# EAGLE design basic-handheld-turbidimeter (EAGLE 7.3.0)
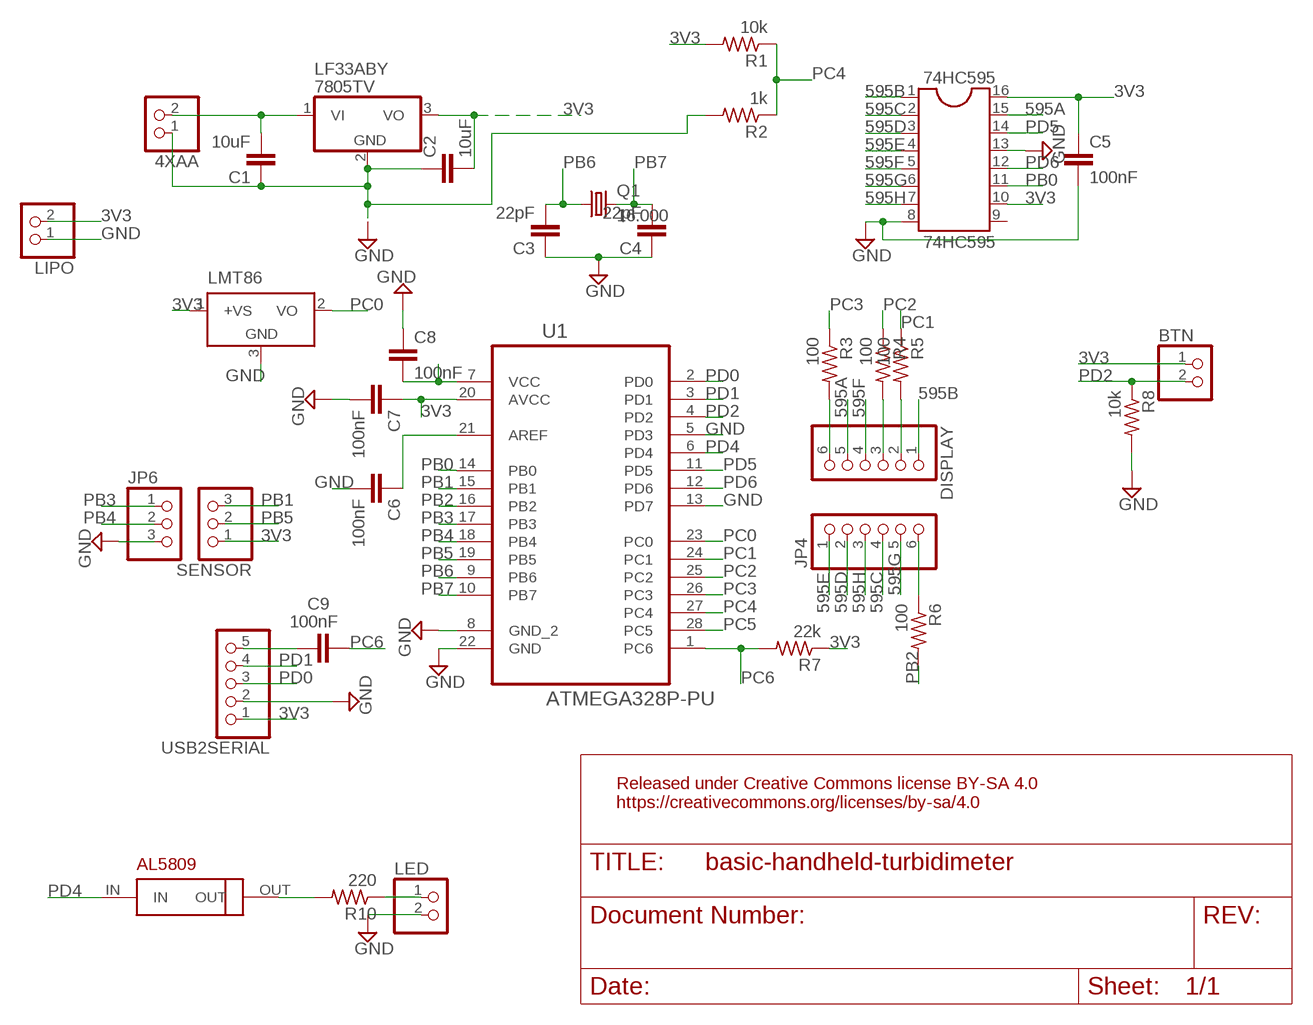
[diagram p0: schematic, sheet 1]

## Parts
4XAA  PINHD-1X2  [1X02]
74HC595  74HC595  DIL16  [DIL16]
BTN  PINHD-1X2  [1X02]
C1  10uF  CAPEZ  [CAP-PTH-SMALLEZ]
C2  10uF  CAPEZ  [CAP-PTH-SMALLEZ]
C3  22pF  CAPEZ  [CAP-PTH-SMALLEZ]
C4  22pF  CAPEZ  [CAP-PTH-SMALLEZ]
C5  100nF  CAPEZ  [CAP-PTH-SMALLEZ]
C6  100nF  CAPEZ  [CAP-PTH-SMALLEZ]
C7  100nF  CAPEZ  [CAP-PTH-SMALLEZ]
C8  100nF  CAPEZ  [CAP-PTH-SMALLEZ]
C9  100nF  CAPEZ  [CAP-PTH-SMALLEZ]
DISPLAY  PINHD-1X6  [1X06]
JP4  PINHD-1X6  [1X06]
JP6  PINHD-1X3  [1X03]
LED  PINHD-1X2  [1X02]
LF33ABY  7805TV  [TO220V]
LIPO  PINHD-1X2  [1X02]
LMT86  LM35CZ  [TO92]
Q1  16.000  CRYSTALHC49S  [HC49/S]
R1  10k  R-US_0207/12  [0207/12]
R2  1k  R-US_0207/12  [0207/12]
R3  100  R-US_0207/12  [0207/12]
R4  100  R-US_0207/12  [0207/12]
R5  100  R-US_0207/12  [0207/12]
R6  100  R-US_0207/12  [0207/12]
R7  22k  R-US_0207/12  [0207/12]
R8  10k  R-US_0207/12  [0207/12]
R10  220  R-US_0207/12  [0207/12]
SENSOR  PINHD-1X3  [1X03]
U1  ATMEGA328P-PU  [DIP254P762X457-28]
U$6  AL5809  [AL5809]
USB2SERIAL  PINHD-1X5  [1X05]

## Nets
3V3: 74HC595.10 74HC595.16 BTN.1 C2.2 C5.1 C7.1 C8.2 LF33ABY.3(VO) LIPO.2 LMT86.1(+VS) R1.2 R7.1 SENSOR.1 U1.7(VCC) U1.20(AVCC) USB2SERIAL.1
595A: 74HC595.15 DISPLAY.5
595B: 74HC595.1 DISPLAY.1
595C: 74HC595.2 JP4.4
595D: 74HC595.3 JP4.2
595E: 74HC595.4 JP4.1
595F: 74HC595.5 DISPLAY.4
595G: 74HC595.6 JP4.5
595H: 74HC595.7 JP4.3
GND: 4XAA.1 74HC595.8 74HC595.13 C1.1 C2.1 C3.1 C4.1 C5.2 C6.2 C7.2 C8.1 JP6.3 LED.2 LF33ABY.2(GND) LIPO.1 LMT86.3(GND) R2.2 R8.2 U1.5(PD3) U1.8(GND_2) U1.13(PD7) U1.22(GND) USB2SERIAL.2
LED: LED.1 R10.1
N$1: 4XAA.2 C1.2 LF33ABY.1(VI)
N$2: R10.2 U$6.OUT
N$3: C6.1 U1.21(AREF)
N$6: C9.2 USB2SERIAL.5
N$11: DISPLAY.6 R3.2
N$15: DISPLAY.3 R4.2
N$16: DISPLAY.2 R5.2
N$18: JP4.6 R6.1
PB0: 74HC595.11 U1.14(PB0)
PB1: SENSOR.3 U1.15(PB1)
PB2: R6.2 U1.16(PB2)
PB3: JP6.1 U1.17(PB3)
PB4: JP6.2 U1.18(PB4)
PB5: SENSOR.2 U1.19(PB5)
PB6: C3.2 Q1.1 U1.9(PB6)
PB7: C4.2 Q1.2 U1.10(PB7)
PC0: LMT86.2(VO) U1.23(PC0)
PC1: R5.1 U1.24(PC1)
PC2: R4.1 U1.25(PC2)
PC3: R3.1 U1.26(PC3)
PC4: R1.1 R2.1 U1.27(PC4)
PC5: U1.28(PC5)
PC6: C9.1 R7.2 U1.1(PC6)
PD0: U1.2(PD0) USB2SERIAL.3
PD1: U1.3(PD1) USB2SERIAL.4
PD2: BTN.2 R8.1 U1.4(PD2)
PD4: U1.6(PD4) U$6.IN
PD5: 74HC595.14 U1.11(PD5)
PD6: 74HC595.12 U1.12(PD6)
Unconnected: 74HC595.9

## Notes on the sheet
- Released under Creative Commons license BY-SA 4.0
  https://creativecommons.org/licenses/by-sa/4.0

## Library data of the parts
4XAA BTN LED LIPO = pinhead:PINHD-1X2: PIN HEADER
74HC595 = ic-package:DIL16: Dual In Line / Socket
C1-C9 = SparkFun-Capacitors:CAP: Capacitor Standard 0603 ceramic capacitor, and 0.1" leaded capacitor.
DISPLAY JP4 = pinhead:PINHD-1X6: PIN HEADER
JP6 SENSOR = pinhead:PINHD-1X3: PIN HEADER
LF33ABY = linear:78*: Positive VOLTAGE REGULATOR Source: http://cache.national.com/ds/LM/LM78L05.pdf http://www.fairchildsemi.com/ds/LM/LM7805.pdf
LMT86 = lm35:LM35: Single-Supply Centigrade Temperature Sensor Vout = (10mV/°C x Temp °C) +5mmmV Source: http://www.national.com/ds/LM/LM35.pdf
Q1 = adafruit:CRYSTAL: CRYSTAL; OC_FARNELL: 1667008; OC_NEWARK: unknown
R1-R8 R10 = rcl:R-US_: RESISTOR, American symbol
U1 = Atmel_By_element14_Batch_1-00:ATMEGA328P-PU: 8-bit Microcontroller with In-System Programmable Flash; MPN: ATMEGA328P-PU; OC_FARNELL: 1715487; OC_NEWARK: 15R0268; PACKAGE: PDIP-28; SUPPLIER: Atmel
U$6 = awqua_eagle_library:AL5809
USB2SERIAL = pinhead:PINHD-1X5: PIN HEADER

## Board
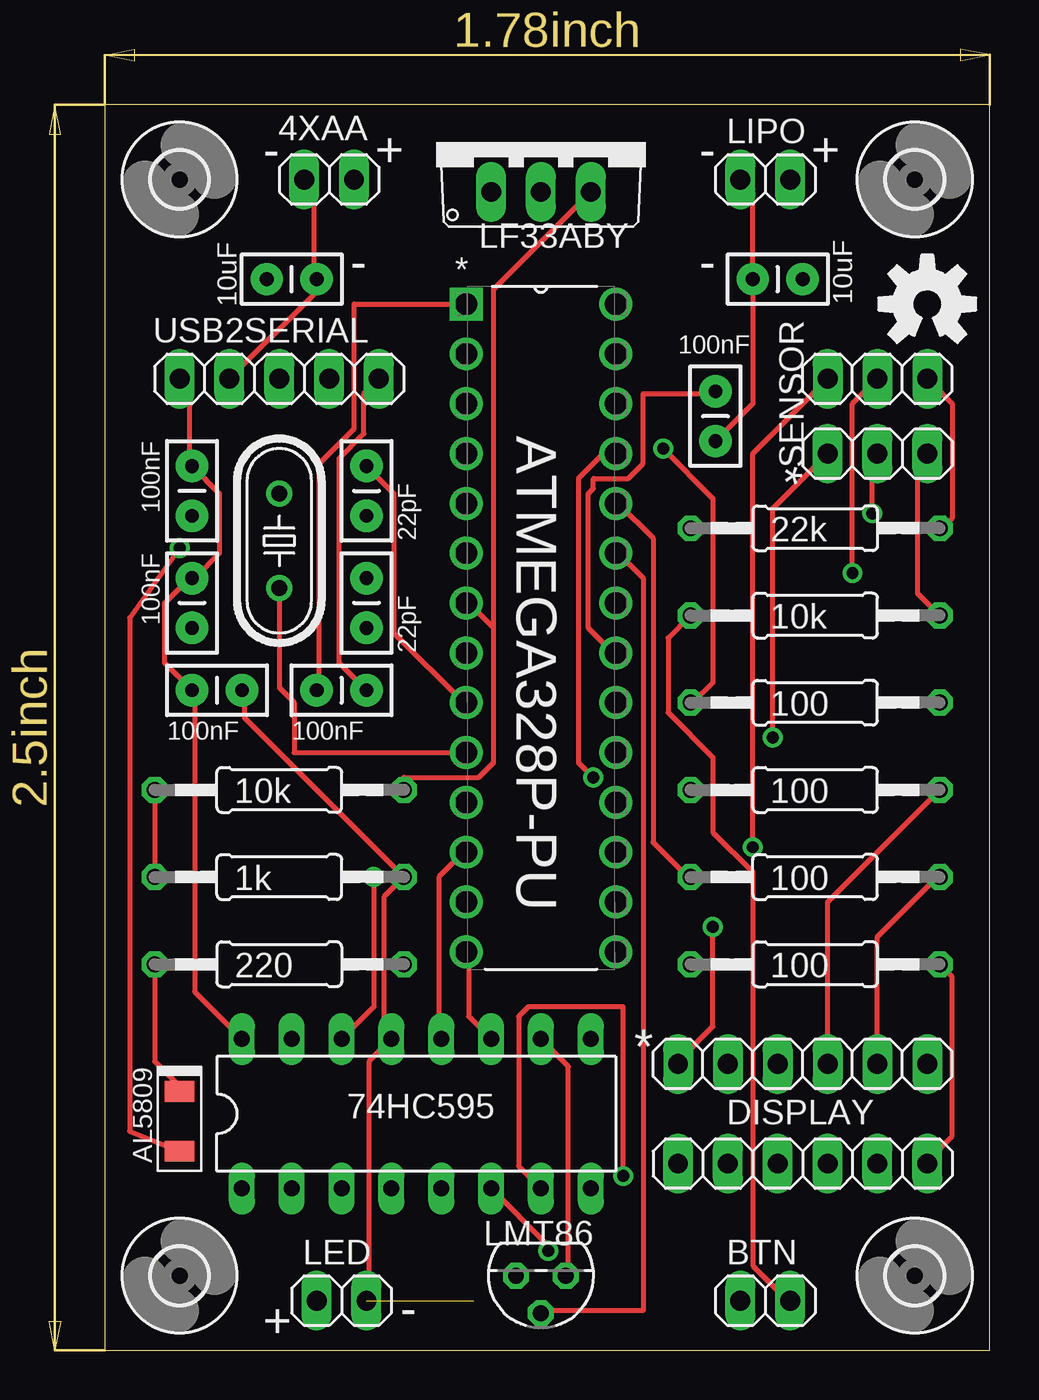
[diagram p1: board, top side]
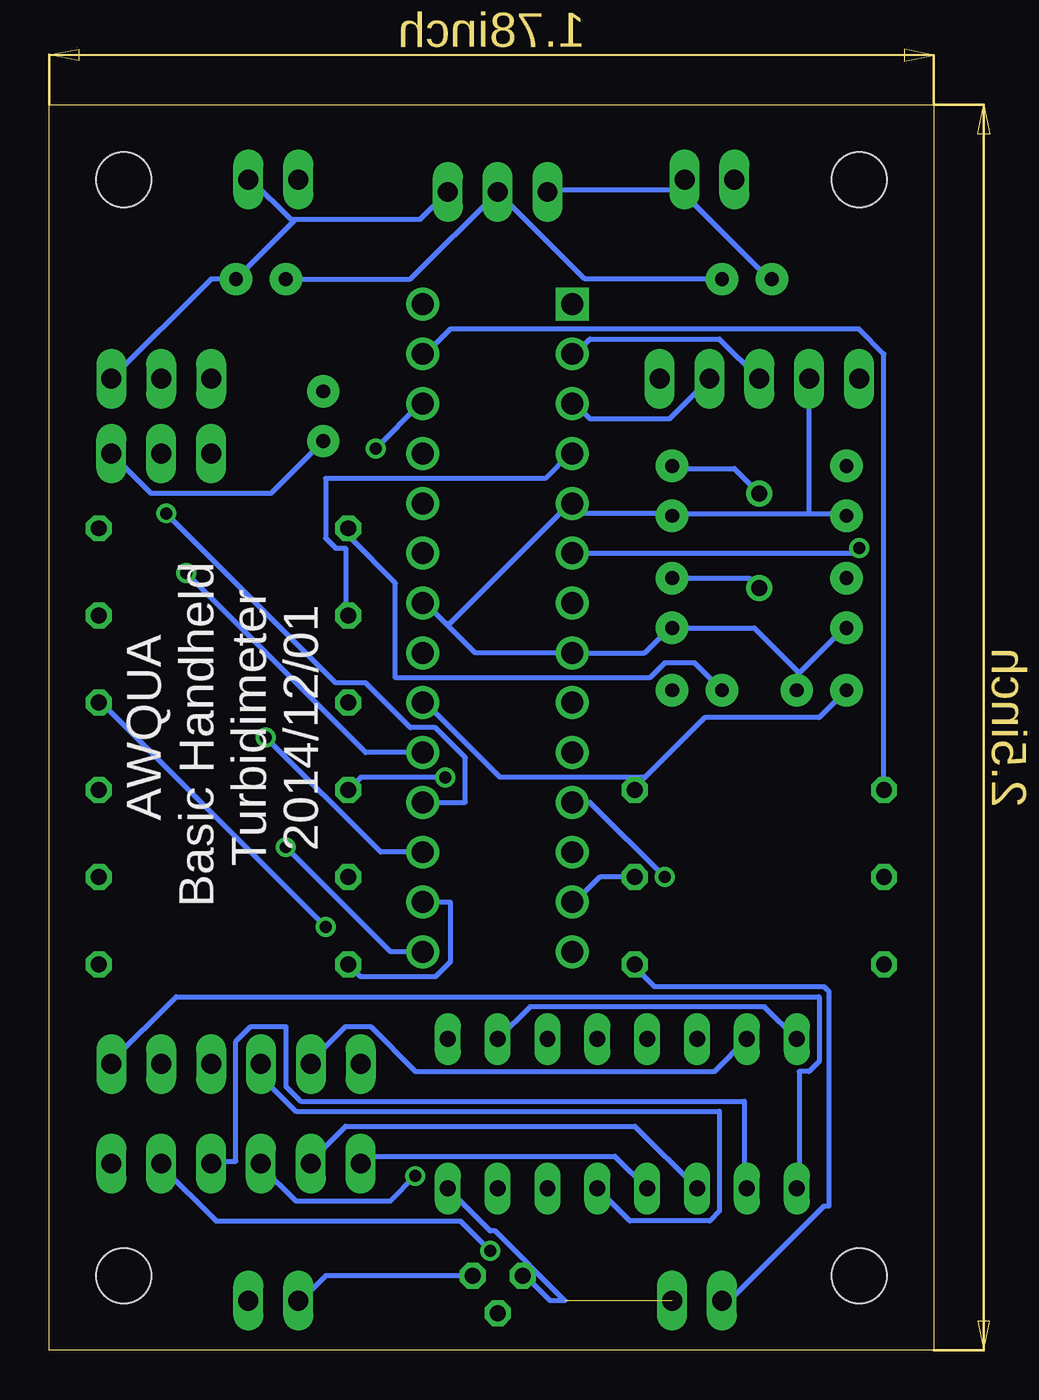
[diagram p2: board, bottom side, seen from below]

Size 45.09 x 63.5 mm. Coordinates in mm from the lower left corner, seen from the top.
Outline: 0,0 45.09,0 45.09,63.5 0,63.49 0,0
Copper layers (1*16): Top 0.035mm / dielectric 1.5mm / Bottom 0.035mm
Design rules "default": minimum track width 10mil, minimum drill 24mil, track to track 8mil, track to pad 8mil, pad to pad 8mil, via to via 8mil, smd to smd 8mil, copper to edge 40mil, drill to drill 8mil, minimum pad ring 10mil, minimum via ring 8mil, stop-mask expansion 4mil, vias tented up to drill 0mil, thermal gap 10mil

### Footprints (pad centres in the part's own frame; a part is rotated, then mirrored left to right if it is on the bottom)
1X02 = drill 1.016 long: 1 -1.27,0; 2 1.27,0
DIL16 = drill 0.813 long: 1 -8.89,-3.81; 2 -6.35,-3.81; 3 -3.81,-3.81; 4 -1.27,-3.81; 5 1.27,-3.81; 6 3.81,-3.81; 7 6.35,-3.81; 8 8.89,-3.81; 9 8.89,3.81; 10 6.35,3.81; 11 3.81,3.81; 12 1.27,3.81; 13 -1.27,3.81; 14 -3.81,3.81; 15 -6.35,3.81; 16 -8.89,3.81
CAP-PTH-SMALLEZ = drill 0.7 pad 1.651: 1 0,0; 2 2.54,0
1X06 = drill 1.016 long: 1 -6.35,0; 2 -3.81,0; 3 -1.27,0; 4 1.27,0; 5 3.81,0; 6 6.35,0
1X03 = drill 1.016 long: 1 -2.54,0; 2 0,0; 3 2.54,0
TO220V = drill 1.016 long: 1 -2.54,-2.54; 2 0,-2.54; 3 2.54,-2.54
TO92 = drill 0.813 octagon: 1 -1.27,0; 2 0,1.905; 3 1.27,0
HC49/S = drill 0.813: 1 -2.413,0; 2 2.413,0
0207/12 = drill 0.813 octagon: 1 -6.35,0; 2 6.35,0
DIP254P762X457-28 = drill 1.118 square: 1 -7.62,33.02 | drill 1.118: 2 -7.62,30.48; 3 -7.62,27.94; 4 -7.62,25.4; 5 -7.62,22.86; 6 -7.62,20.32; 7 -7.62,17.78; 8 -7.62,15.24; 9 -7.62,12.7; 10 -7.62,10.16; 11 -7.62,7.62; 12 -7.62,5.08; 13 -7.62,2.54; 14 -7.62,0; 15 0,0; 16 0,2.54; 17 0,5.08; 18 0,7.62; 19 0,10.16; 20 0,12.7; 21 0,15.24; 22 0,17.78; 23 0,20.32; 24 0,22.86; 25 0,25.4; 26 0,27.94; 27 0,30.48; 28 0,33.02
2,8 = hole 2.8: 0,0
AL5809 = smd 1.05 x 1.5: IN 0,0; OUT 3.05,0
1X05 = drill 1.016 long: 1 -5.08,0; 2 -2.54,0; 3 0,0; 4 2.54,0; 5 5.08,0

### Placement (x,y rotation side)
4XAA  11.43,59.69 0 top
74HC595  15.88,12.06 0 top
BTN  33.66,2.54 0 top
C1  10.79,54.61 180 top
C2  33.02,54.61 0 top
C3  13.34,42.55 90 top
C4  13.34,36.83 90 top
C5  4.45,33.66 0 top
C6  31.11,48.9 270 top
C7  4.45,45.09 270 top
C8  4.45,36.83 90 top
C9  10.79,33.66 0 top
DISPLAY  35.56,14.61 180 top
JP4  35.56,9.53 0 top
JP6  39.37,45.72 0 top
LED  12.06,2.54 0 top
LF33ABY  22.23,61.59 0 top
LIPO  33.66,59.69 0 top
LMT86  22.23,3.81 180 top
Q1  8.89,41.27 270 top
R1  8.89,28.57 0 top
R2  8.89,24.13 0 top
R3  36.2,33.02 0 top
R4  36.2,28.57 0 top
R5  36.2,24.13 0 top
R6  36.2,19.68 180 top
R7  36.2,41.91 180 top
R8  36.2,37.47 0 top
R10  8.89,19.68 180 top
SENSOR  39.37,49.53 180 top
U1  26.04,20.32 0 top
U$1  [2,8]  3.81,59.69 0 top
U$2  [2,8]  41.27,59.69 0 top
U$3  [2,8]  3.81,3.81 0 top
U$4  [2,8]  41.27,3.81 0 top
U$5  [OSHW-LOGO-M]  41.91,53.34 0 top
U$6  3.81,10.16 90 top
USB2SERIAL  8.89,49.53 0 top

### Tracks (layer width: path | path; a pad name or v marks a point on that pad's centre or on a via)
3V3
  Top 0.254: SENSOR.1 43.18,48.26 43.18,42.42 42.67,41.91 R7.1 | 74HC595.10 23.62,14.48 23.62,3.81 LMT86.1 | USB2SERIAL.1 4.32,49.02 4.32,45.21 C7.1 5.84,43.69 5.84,40.64 4.57,39.37 C8.2 4.32,39.37 3.05,38.1 3.05,35.05 C5.1 4.57,33.53 4.57,18.29 74HC595.16 | 19.81,36.83 18.54,38.1 U1.7 | 19.81,36.83 19.81,29.97 19.05,29.21 15.24,29.21 R1.2 | LF33ABY.3 19.81,54.1 19.81,36.83
  Bottom 0.254: LF33ABY.3 26.16,57.66 32.51,57.66 | 32.51,57.66 32.77,57.66 34.8,59.69 LIPO.2 | 32.51,57.66 C2.2 36.83,54.61 SENSOR.1 | LMT86.1 30.99,3.81 32.26,2.54 BTN.1 | 14.73,29.21 11.68,32.26 5.84,32.26 C5.1 | 14.73,29.21 15.24,28.7 R1.2 | 14.73,29.21 22.1,29.21 25.91,33.02 U1.20 | 74HC595.10 20.57,17.53 8.64,17.53 74HC595.16
595A
  Bottom 0.254: 74HC595.15 11.18,14.22 26.42,14.22 28.7,16.51 29.97,16.51 31.75,14.73 DISPLAY.5
595B
  Bottom 0.254: 74HC595.1 6.86,8.38 6.86,14.22 6.35,14.22 5.84,14.73 5.84,18.03 38.61,18.03 41.91,14.73 DISPLAY.1
595C
  Bottom 0.254: 74HC595.2 9.65,8.38 9.65,12.7 32.26,12.7 33.02,13.46 33.02,16.51 34.8,16.51 35.56,15.75 35.56,9.65 36.83,9.65 JP4.4
595D
  Bottom 0.254: 74HC595.3 15.24,11.43 29.97,11.43 31.75,9.65 JP4.2
595E
  Bottom 0.254: 74HC595.4 16.26,9.91 28.96,9.91 29.21,9.65 JP4.1
595F
  Bottom 0.254: 74HC595.5 15.49,6.6 11.43,6.6 10.92,7.11 10.92,12.19 32.51,12.19 34.29,13.97 DISPLAY.4
595G  (via drill 0.61)
  Top 0.254: 74HC595.6 22.61,5.33 v22.61,5.08
  Bottom 0.254: v22.61,5.08 24.13,6.6 36.58,6.6 39.37,9.4 JP4.5
595H  (via drill 0.61)
  Top 0.254: 74HC595.7 21.08,9.4 21.08,17.02 21.59,17.53 26.42,17.53 v26.42,8.89
  Bottom 0.254: v26.42,8.89 27.69,7.62 32.51,7.62 34.29,9.4 JP4.3
GND  (2 unrouted)
  Top 0.254: R8.2 41.4,38.61 41.4,45.21 JP6.3 | LIPO.1 32.51,59.69 33.02,59.18 C2.1 33.02,48.26 C6.2 | USB2SERIAL.2 10.67,53.85 10.67,54.61 | 4XAA.1 10.67,59.18 10.67,54.61 | 10.67,54.61 C1.1 | C5.2 7.11,33.53 7.11,32.26 R2.2 14.22,23.11 14.22,16.26 74HC595.13 13.46,14.73 13.46,2.54
  Bottom 0.254: C2.1 26.67,54.61 LF33ABY.2 17.78,54.61 C1.1 | JP6.3 39.88,43.69 33.78,43.69 C6.2 | 6.35,42.67 13.21,42.67 C3.1 13.46,42.67 17.78,42.67 18.29,43.18 U1.5 18.54,43.18 24.64,37.08 24.89,37.08 | 6.35,42.67 4.57,42.67 C7.2 | 6.35,42.67 USB2SERIAL.2 | LMT86.3 20.83,3.81 19.56,2.54 18.8,2.54 22.35,6.1 22.61,6.1 74HC595.8 | R2.2 17.02,24.13 18.29,22.86 U1.13 | 6.86,34.54 4.57,36.83 C8.1 | 6.86,34.54 6.86,33.78 C5.2 | 24.89,37.08 23.37,35.56 U1.8 14.73,35.56 13.46,36.83 C4.1 9.14,36.83 6.86,34.54 | 24.89,37.08 25.91,38.1 U1.22
LED
  Bottom 0.254: LED.1 10.41,2.54 5.59,7.37 5.33,7.37 5.33,18.29 5.59,18.54 14.22,18.54 15.24,19.56 R10.1
N$1
  Bottom 0.254: 13.21,59.18 19.56,59.18 LF33ABY.1 | 13.21,59.18 12.95,59.18 8.38,54.61 C1.2 | 13.21,59.18 4XAA.2
N$2
  Top 0.254: R10.2 2.54,14.73 3.81,13.46 U$6.OUT
N$3
  Top 0.254: C6.1 30.99,48.77 27.43,48.77 27.43,45.21 26.67,44.45 24.89,44.45 24.89,43.94 24.64,43.69 24.64,36.83 25.91,35.56 U1.21
N$6
  Top 0.254: USB2SERIAL.5 13.21,48.77 13.21,46.74 11.94,45.47 11.94,35.05 C9.2
N$11  (via drill 0.61)
  Top 0.254: v30.99,21.59 30.99,16.51 29.21,14.73 DISPLAY.6
  Bottom 0.254: v30.99,21.59 42.42,33.02 R3.2
N$15
  Top 0.254: R4.2 36.83,22.86 DISPLAY.3
N$16
  Top 0.254: DISPLAY.2 39.37,21.08 42.42,24.13 R5.2
N$18
  Top 0.254: R6.1 43.18,19.05 43.18,10.92 41.91,9.65 JP4.6
PB0
  Top 0.254: 74HC595.11 18.54,17.02 18.54,20.32 U1.14
PB1  (via drill 0.61)
  Top 0.254: SENSOR.3 33.02,45.72 v33.02,25.65
  Bottom 0.254: v33.02,25.65 27.69,20.32 U1.15
PB2
  Bottom 0.254: R6.2 29.21,19.05 25.4,19.05 24.64,19.81 24.64,22.86 U1.16
PB3  (via drill 0.61)
  Top 0.254: JP6.1 34.04,42.93 v34.04,31.24
  Bottom 0.254: v34.04,31.24 28.19,25.4 U1.17
PB4  (via drill 0.61)
  Top 0.254: JP6.2 39.12,45.47 v39.12,42.67
  Bottom 0.254: v39.12,42.67 30.48,34.04 28.96,34.04 26.67,31.75 25.4,31.75 23.88,30.23 23.88,27.94 U1.18
PB5  (via drill 0.61)
  Top 0.254: SENSOR.2 38.1,48.26 v38.1,39.62
  Bottom 0.254: v38.1,39.62 28.96,30.48 U1.19
PB6
  Top 0.254: C3.2 14.73,43.69 14.73,36.58 18.29,33.02 U1.9
  Bottom 0.254: Q1.1 10.16,44.96 13.21,44.96 C3.2
PB7
  Top 0.254: U1.10 9.65,30.48 9.65,33.02 8.89,33.78 Q1.2
  Bottom 0.254: Q1.2 9.4,39.37 C4.2
PC0
  Top 0.254: LMT86.2 22.35,2.03 27.43,2.03 27.43,39.37 26.16,40.64 U1.23
PC1
  Top 0.254: R5.1 29.72,24.13 27.94,25.91 27.94,41.4 26.16,43.18 U1.24
PC2  (via drill 0.61)
  Top 0.254: v24.89,29.21 24.13,29.97 24.13,44.45 25.4,45.72 U1.25
  Bottom 0.254: R4.1 29.21,29.21 v24.89,29.21
PC3  (via drill 0.61)
  Top 0.254: v28.45,45.97 30.99,43.43 30.99,34.04 29.97,33.02 R3.1
  Bottom 0.254: v28.45,45.97 26.16,48.26 U1.26
PC4
  Top 0.254: R1.1 R2.1
  Bottom 0.254: R1.1 2.54,50.8 3.81,52.07 24.64,52.07 25.91,50.8 U1.27
PC6
  Top 0.254: U1.1 12.7,53.34 12.7,46.99 10.92,45.21 10.92,33.78 C9.1
  Bottom 0.254: C9.1 12.19,35.05 13.72,35.05 14.48,34.29 27.43,34.29 27.43,39.12 29.72,41.4 29.72,41.91 R7.2
PD0
  Bottom 0.254: USB2SERIAL.3 10.92,51.56 17.53,51.56 18.29,50.8 U1.2
PD1
  Bottom 0.254: USB2SERIAL.4 13.46,47.5 17.53,47.5 18.29,48.26 U1.3
PD2
  Top 0.254: R8.1 28.7,36.32 28.7,32.51 30.99,30.23 30.99,26.42 33.02,24.38 33.02,4.32 34.8,2.54 BTN.2
  Bottom 0.254: R8.1 29.97,37.59 29.97,40.89 30.48,40.89 30.99,41.4 30.99,44.45 19.81,44.45 18.54,45.72 U1.4
PD4  (via drill 0.61)
  Top 0.254: U$6.IN 1.27,11.18 1.27,37.34 v3.81,40.89
  Bottom 0.254: v3.81,40.89 4.06,40.64 U1.6
PD5  (via drill 0.61)
  Top 0.254: 74HC595.14 13.72,17.53 v13.72,24.13
  Bottom 0.254: v13.72,24.13 17.53,27.94 U1.11
PD6
  Top 0.254: 74HC595.12 17.02,16 17.02,24.13 18.29,25.4 U1.12

### Text on the board
tNames: - | + | - | + | - | - | * | * | + | -
bNames: AWQUA / Basic Handheld / Turbidimeter / 2014/12/01
Document: Released under Creative Commons license BY-SA 4.0 / https://creativecommons.org/licenses/by-sa/4.0